# EAGLE design pixljs (EAGLE 7.7.0)
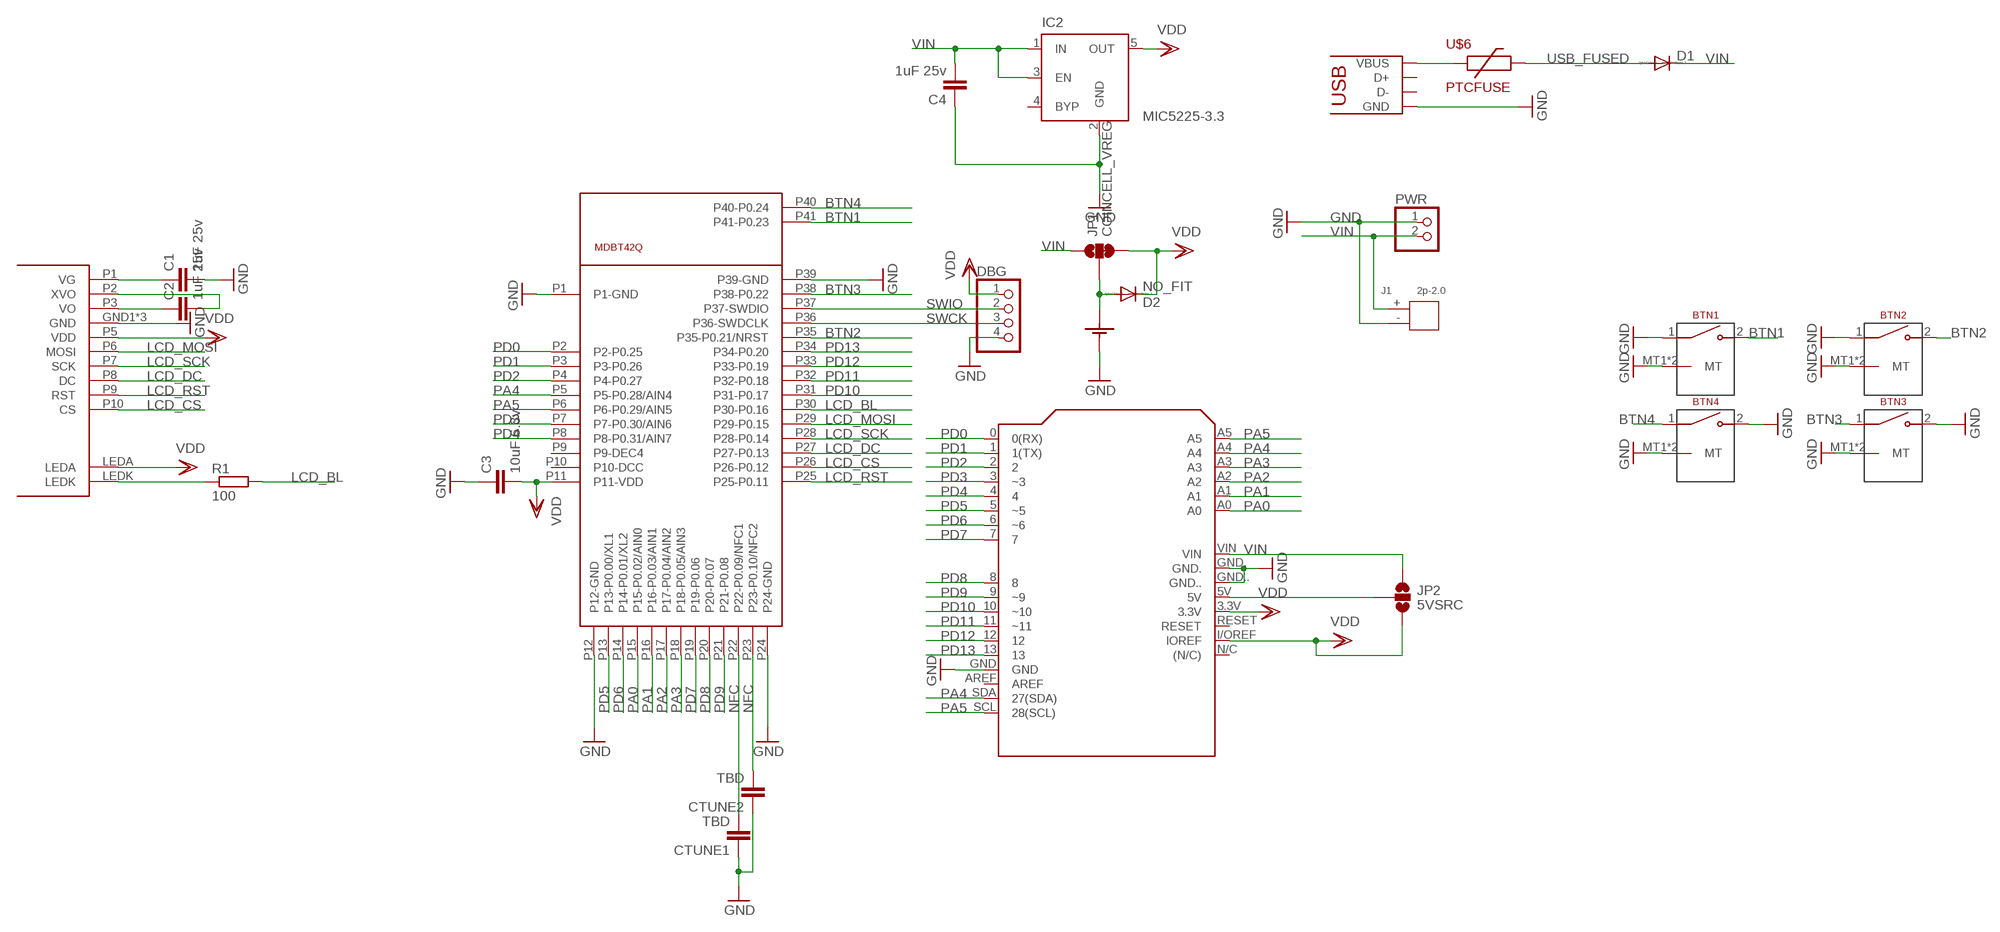
[diagram p0: schematic, sheet 1]

## Parts
BTN1  TACT_MINI_RIGHT_ANGLEMEDI  [TACT_MEDI_RIGHT_ANGLE]
BTN2  TACT_MINI_RIGHT_ANGLEMEDI  [TACT_MEDI_RIGHT_ANGLE]
BTN3  TACT_MINI_RIGHT_ANGLEMEDI  [TACT_MEDI_RIGHT_ANGLE]
BTN4  TACT_MINI_RIGHT_ANGLEMEDI  [TACT_MEDI_RIGHT_ANGLE]
C1  1uF 25v  C-EUC0603K  [C0603K]
C2  1uF 25v  C-EUC0603K  [C0603K]
C3  10uF 6.3v  C-EUC0603K  [C0603K]
C4  1uF 25v  C-EUC0603K  [C0603K]
CTUNE1  TBD  C-EUC0603K  [C0603K]
CTUNE2  TBD  C-EUC0603K  [C0603K]
D1  DIODE-SOD323-W  [SOD323-W]
D2  NO_FIT  DIODE-SOD323-W  [SOD323-W]
DBG  PINHD-1X04_2.54-S  [1X04-S]
IC2  MIC5225-3.3  MIC5219XX  [SOT23-5]
J1  2p-2.0  DIP-JST-2P-2.0  [H2-2.0-6X4.5MM]
JP1  COINCELL_VREG  JUMPER-SMT_3_1-NC_TRACE_NO-SILK  [SMT-JUMPER_3_1-NC_TRACE_NO-SILK]
JP2  5VSRC  JUMPER-SMT_3_NO_NO-SILK  [SMT-JUMPER_3_NO_NO-SILK]
PWR  PINHD-1X02_2.54-S  [1X02-S]
R1  100  R-EU_R0603  [R0603]
U$1  JHD12864  [JHD12864-G176BSW]
U$2  MDBT42Q  [MDBT40]
U$3  CR2032-SMD  [CR2032-SMD]
U$4  ARDUINO  [ARDUINO]
U$5  USB-MICROB  [USB-MICROB]
U$6  PTCFUSE  [R1210]

## Nets
BTN1: BTN1.2 U$2.P41(P41-P0.23)
BTN2: BTN2.2 U$2.P35(P35-P0.21/NRST)
BTN3: BTN3.1 U$2.P38(P38-P0.22)
BTN4: BTN4.1 U$2.P40(P40-P0.24)
GND: BTN1.1 BTN1.MT1(MT) BTN1.MT2(MT) BTN2.1 BTN2.MT1(MT) BTN2.MT2(MT) BTN3.2 BTN3.MT1(MT) BTN3.MT2(MT) BTN4.2 BTN4.MT1(MT) BTN4.MT2(MT) C1.2 C3.1 C4.1 CTUNE1.1 CTUNE2.1 DBG.4 IC2.2(GND) J1.- PWR.1 U$1.GND1(GND) U$1.GND2(GND) U$1.P4(GND) U$2.P1(P1-GND) U$2.P12(P12-GND) U$2.P24(P24-GND) U$2.P39(P39-GND) U$3.NEG(-) U$4.GND U$4.GND. U$4.GND.. U$5.GND U$5.MT1(GND) U$5.MT2(GND) U$5.P$1(GND) U$5.P$2(GND) U$5.P$3(GND) U$5.P$4(GND)
LCD_BL: R1.2 U$2.P30(P30-P0.16)
LCD_CS: U$1.P10(CS) U$2.P26(P26-P0.12)
LCD_DC: U$1.P8(DC) U$2.P27(P27-P0.13)
LCD_MOSI: U$1.P6(MOSI) U$2.P29(P29-P0.15)
LCD_RST: U$1.P9(RST) U$2.P25(P25-P0.11)
LCD_SCK: U$1.P7(SCK) U$2.P28(P28-P0.14)
N$1: D2.A JP1.2 U$3.POS1(+) U$3.POS2(+)
N$2: C2.1 U$1.P3(VO)
N$3: C2.2 U$1.P2(XVO)
N$4: C1.1 U$1.P1(VG)
N$5: R1.1 U$1.LEDK
N$6: U$5.VBUS U$6.1
N$7: JP2.2 U$4.5V
NFC: CTUNE1.2 CTUNE2.2 U$2.P22(P22-P0.09/NFC1) U$2.P23(P23-P0.10/NFC2)
PA0: U$2.P15(P15-P0.02/AIN0) U$4.A0
PA1: U$2.P16(P16-P0.03/AIN1) U$4.A1
PA2: U$2.P17(P17-P0.04/AIN2) U$4.A2
PA3: U$2.P18(P18-P0.05/AIN3) U$4.A3
PA4: U$2.P5(P5-P0.28/AIN4) U$4.A4 U$4.SDA(27(SDA))
PA5: U$2.P6(P6-P0.29/AIN5) U$4.A5 U$4.SCL(28(SCL))
PD0: U$2.P2(P2-P0.25) U$4.0(0(RX))
PD1: U$2.P3(P3-P0.26) U$4.1(1(TX))
PD2: U$2.P4(P4-P0.27) U$4.2
PD3: U$2.P7(P7-P0.30/AIN6) U$4.3(~3)
PD4: U$2.P8(P8-P0.31/AIN7) U$4.4
PD5: U$2.P13(P13-P0.00/XL1) U$4.5(~5)
PD6: U$2.P14(P14-P0.01/XL2) U$4.6(~6)
PD7: U$2.P19(P19-P0.06) U$4.7
PD8: U$2.P20(P20-P0.07) U$4.8
PD9: U$2.P21(P21-P0.08) U$4.9(~9)
PD10: U$2.P31(P31-P0.17) U$4.10(~10)
PD11: U$2.P32(P32-P0.18) U$4.11(~11)
PD12: U$2.P33(P33-P0.19) U$4.12
PD13: U$2.P34(P34-P0.20) U$4.13
SWCK: DBG.3 U$2.P36(P36-SWDCLK)
SWIO: DBG.2 U$2.P37(P37-SWDIO)
USB_FUSED: D1.A U$6.2
VDD: C3.2 D2.C DBG.1 IC2.5(OUT) JP1.3 JP2.3 U$1.LEDA U$1.P5(VDD) U$2.P11(P11-VDD) U$4.3.3V U$4.I/OREF(IOREF)
VIN: C4.2 D1.C IC2.1(IN) IC2.3(EN) J1.+ JP1.1 JP2.1 PWR.2 U$4.VIN
Unconnected: IC2.4(BYP) U$2.P9(P9-DEC4) U$2.P10(P10-DCC) U$4.AREF U$4.N/C((N/C)) U$4.RESET U$5.D+ U$5.D-

## Library data of the parts
BTN1-BTN4 = pimoroni-mechanical:TACT_MINI_RIGHT_ANGLE
C1-C4 CTUNE1 CTUNE2 = rcl:C-EU: CAPACITOR, European symbol
D1 D2 = diode:DIODE-: DIODE
DBG = pinhead-2:PINHD-1X04: PIN HEADER
IC2 = v-reg-micrel:MIC5219XX: VOLTAGE REGULATOR; OC_FARNELL: unknown; OC_NEWARK: unknown
J1 = Seeed-OPL-Connector:DIP-JST-2P-2.0: 320110049
JP1 = SparkFun-Jumpers:JUMPER-SMT_3_1-NC_TRACE: Normally closed trace jumper (1 of 2 connections) This jumper has a trace between two pads so it's normally closed (NC). The other connection is normally open (NO). Use a razor knife to open the connection. For best results follow the IPC guidelines for cutting traces: Cutout at least 0.063 mm (0.005 in). Remove all loose material to clean up the cut area. Seal the cut with an approved epoxy. Reapply solder to reclose the connection, or to close the NO connection.
JP2 = SparkFun-Jumpers:JUMPER-SMT_3_NO: Normally open jumper This jumper has three pads in close proximity to each other. Apply solder to close the connection(s).
PWR = pinhead-2:PINHD-1X02: PIN HEADER
R1 = rcl:R-EU_: RESISTOR, European symbol
U$1 = jhd_lcd:JHD12864
U$2 = mdbt42:MDBT42Q
U$3 = pimoroni-mechanical:CR2032-SMD
U$4 = arduino_jslcd:ARDUINO
U$5 = pimoroni:USB-MICROB
U$6 = pimoroni:PTCFUSE

## Board
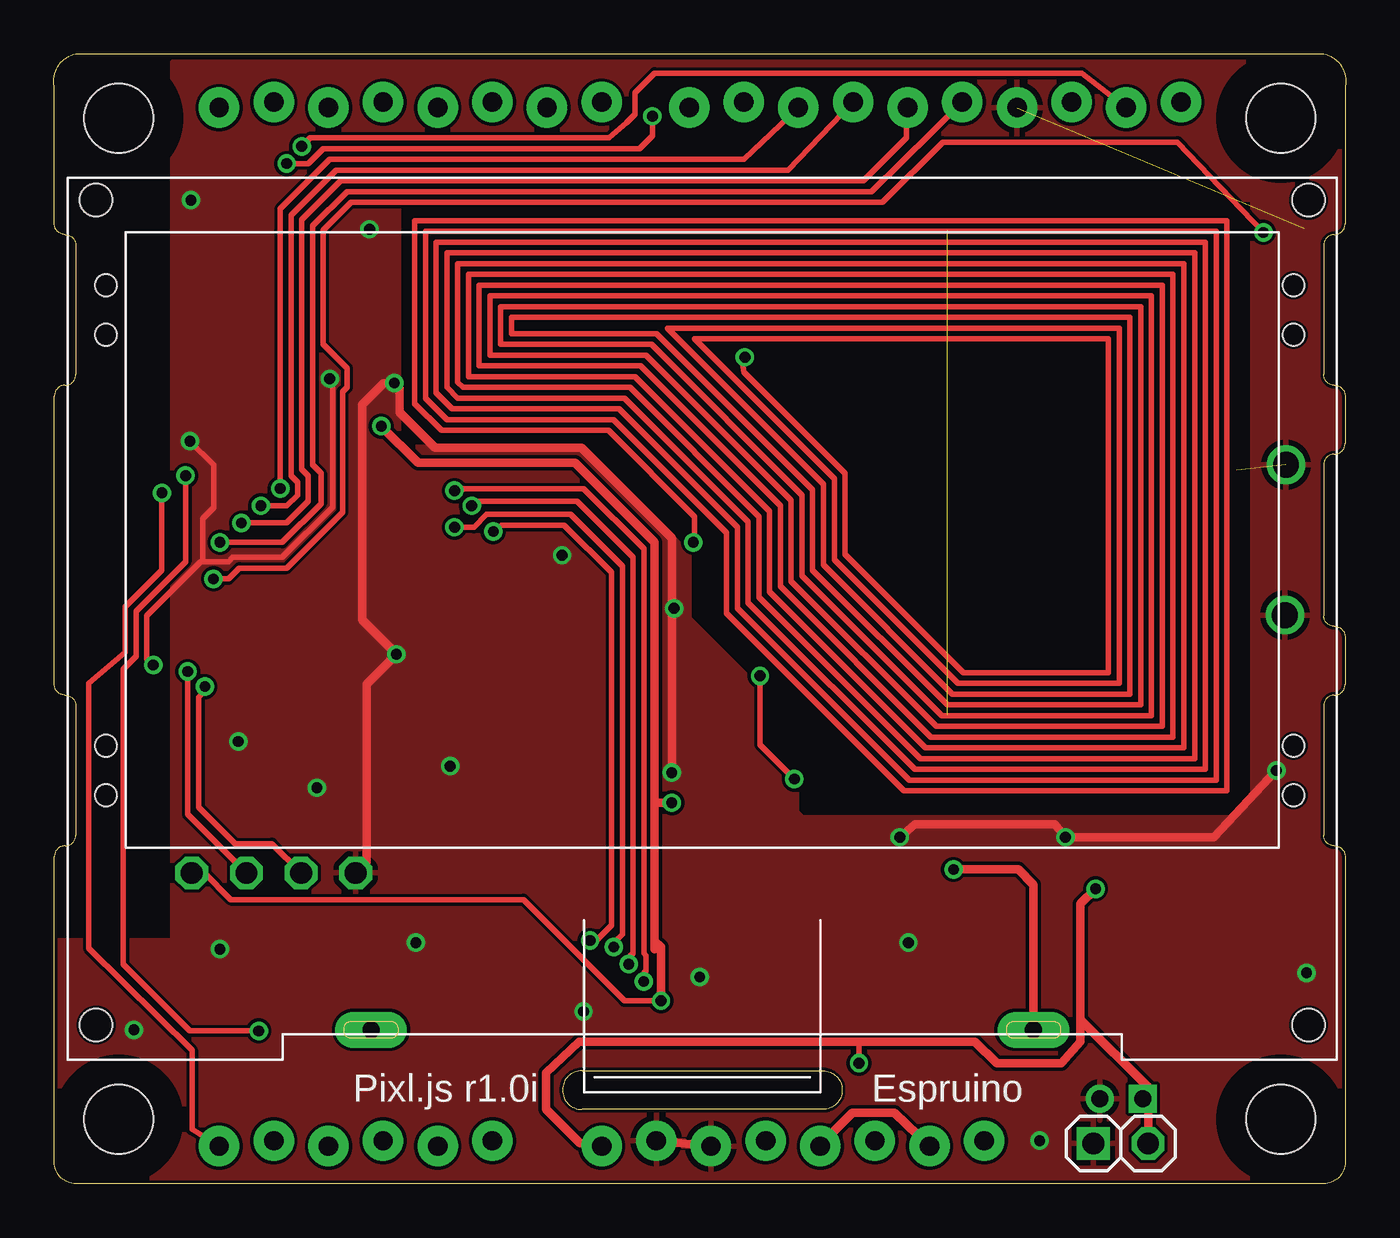
[diagram p1: board, top side]
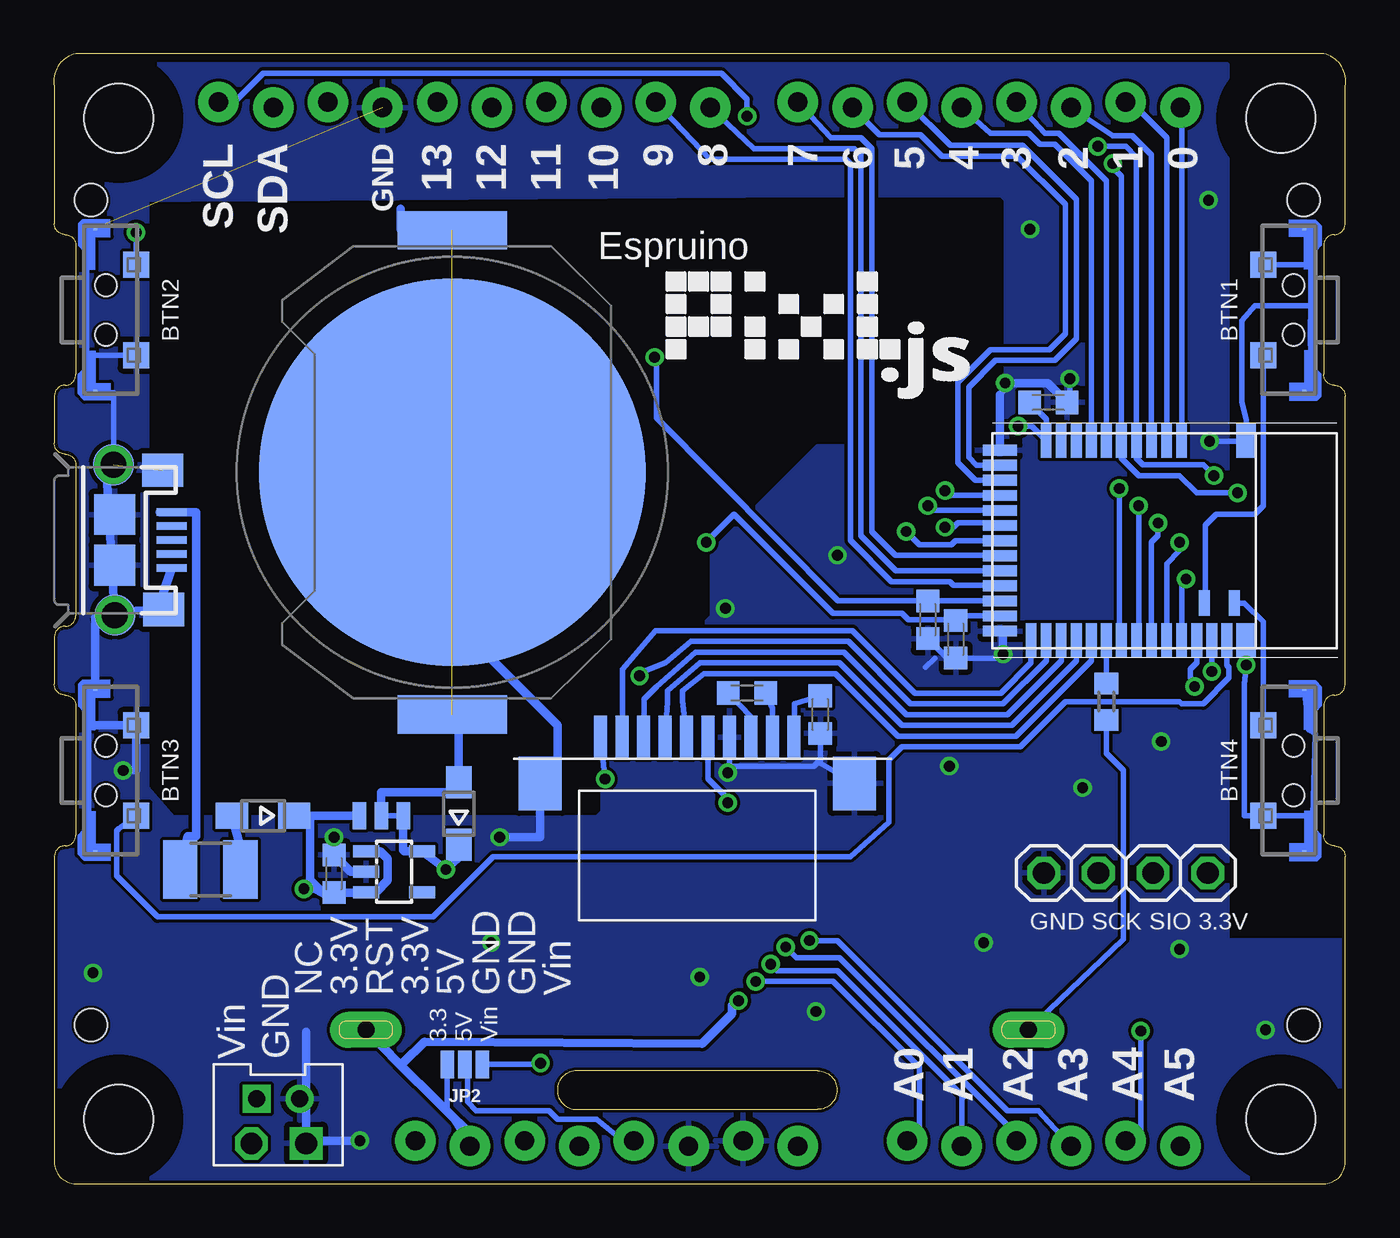
[diagram p2: board, bottom side, seen from below]

Size 60.05 x 52.5 mm. Coordinates in mm from the lower left corner, seen from the top.
Outline: 1.02,52.5 59.02,52.5 arc-90 60.02,51 60.02,44.6 arc-90 59.52,44.1 arc90 59.02,43.6 59.02,37.6 arc90 59.52,37.1 arc-90 60.02,36.6 60.02,34.4 arc-90 59.52,33.9 arc90 59.02,33.4 59.02,26.4 arc90 59.52,25.9 arc-90 60.02,25.4 60.02,23.2 arc-90 59.52,22.7 arc90 59.02,22.2 59.02,16.2 arc90 59.52,15.7 arc-90 60.02,15.2 60.02,1 arc-90 59.02,0 1.02,0 arc-90 0.02,1 0.02,15.2 arc-90 0.52,15.7 arc90 1.02,16.2 1.02,22.2 arc90 0.52,22.7 arc-90 0.02,23.2 0.02,36.6 arc-90 0.52,37.1 arc90 1.02,37.6 1.02,43.6 arc90 0.52,44.1 arc-90 0.02,44.6 0.02,51 arc-90 1.02,52.5
Copper layers (1*16): Top 0.035559375mm / dielectric 0.17018125mm / Bottom 0.035559375mm
Design rules "pimoroni_espruino *": minimum track width 8mil, minimum drill 10mil, track to track 6mil, track to pad 6mil, pad to pad 6mil, via to via 6mil, smd to smd 0mil, copper to edge 6mil, drill to drill 6mil, minimum pad ring 7mil, minimum via ring 7mil, stop-mask expansion 6mil, vias tented up to drill 21mil, thermal gap 10mil

### Footprints (pad centres in the part's own frame; a part is rotated, then mirrored left to right if it is on the bottom)
TACT_MEDI_RIGHT_ANGLE = smd 1.2 x 1.2: 1 -2.1,-1.4; 2 2.1,-1.4 | smd 0.2 x 0.2: MT1 -3.8,0.5; MT2 3.8,0.5 | hole 1: -1.15,0; 1.15,0
C0603K = smd 1.05 x 1.08: 1 -0.875,0; 2 0.875,0
SOD323-W = smd 1.5 x 1.2: A 1.45,0; C -1.45,0
1X04-S = drill 1.016 octagon: 1 -3.81,0; 2 -1.27,0; 3 1.27,0; 4 3.81,0
SOT23-5 = smd 0.55 x 1.2: 1 -0.95,-1.3; 2 0,-1.3; 3 0.95,-1.3; 4 0.95,1.3; 5 -0.95,1.3
H2-2.0-6X4.5MM = drill 0.8 pad 1.3 square: + -1,0.75 | drill 0.8 pad 1.3: - 1,0.75
SMT-JUMPER_3_1-NC_TRACE_NO-SILK = smd 0.635 x 1.27: 1 -1.016,0; 2 0,0; 3 1.016,0
SMT-JUMPER_3_NO_NO-SILK = smd 0.635 x 1.27: 1 -0.813,0; 2 0,0; 3 0.813,0
1X02-S = drill 1.016 square: 1 -1.27,0 | drill 1.016 octagon: 2 1.27,0
R0603 = smd 1 x 1.1: 1 -0.85,0; 2 0.85,0
JHD12864-G176BSW = smd 2 x 2.5 bottom: GND1 22.2,12.85; GND2 36.8,12.85 | drill 0.8 pad 1.676 long: LEDA 44.89,1.4; LEDK 14.1,1.4 | smd 0.6 x 2 bottom: P1 25,15; P2 26,15; P3 27,15; P4 28,15; P5 29,15; P6 30,15; P7 31,15; P8 32,15; P9 33,15; P10 34,15 | hole 1.5: 1.325,1.625; 57.675,1.625; 57.675,39.95; 1.325,39.95
MDBT40 = smd 1.6 x 0.9: P1 -4.65,3.8; P39 4.65,3.8 | smd 1.6 x 0.5: P2 -4.65,0.8; P3 -4.65,0.1; P4 -4.65,-0.6; P5 -4.65,-1.3; P6 -4.65,-2; P7 -4.65,-2.7; P8 -4.65,-3.4; P9 -4.65,-4.1; P10 -4.65,-4.8; P11 -4.65,-5.5; P25 4.65,-6.2; P26 4.65,-5.5; P27 4.65,-4.8; P28 4.65,-4.1; P29 4.65,-3.4; P30 4.65,-2.7; P31 4.65,-2; P32 4.65,-1.3; P33 4.65,-0.6; P34 4.65,0.1; P35 4.65,0.8; P36 4.65,1.5; P37 4.65,2.2; P38 4.65,2.9 | smd 0.5 x 1.6: P12 -4.2,-7.65; P13 -3.5,-7.65; P14 -2.8,-7.65; P15 -2.1,-7.65; P16 -1.4,-7.65; P17 -0.7,-7.65; P18 0,-7.65; P19 0.7,-7.65; P20 1.4,-7.65; P21 2.1,-7.65; P22 2.8,-7.65; P23 3.5,-7.65; P24 4.2,-7.65 | smd 1.2 x 0.5: P40 2.9,3.25; P41 2.9,1.85
CR2032-SMD = smd 18 x 18: NEG 0,0 | smd 1.77 x 5.08: POS1 11.25,0; POS2 -11.25,0
ARDUINO = drill 0.9 pad 1.88: 0 27.94,24.003; 1 25.4,24.257; 2 22.86,24.003; 3 20.32,24.257; 3.3V 0,-24.257; 4 17.78,24.003; 5 15.24,24.257; 5V 2.54,-24.003; 6 12.7,24.003; 7 10.16,24.257; 8 6.096,24.003; 9 3.556,24.257; 10 1.016,24.003; 11 -1.524,24.257; 12 -4.064,24.003; 13 -6.604,24.257; A0 15.24,-24.003; A1 17.78,-24.257; A2 20.32,-24.003; A3 22.86,-24.257; A4 25.4,-24.003; A5 27.94,-24.257; AREF -11.684,24.257; GND -9.144,24.003; GND. 7.62,-24.003; GND.. 5.08,-24.257; I/OREF -5.08,-24.257; N/C -7.62,-24.003; RESET -2.54,-24.003; SCL -16.764,24.257; SDA -14.224,24.003; VIN 10.16,-24.257
USB-MICROB = smd 0.35 x 1.4: D+ 0,2.65; D- -0.65,2.65; GND 1.3,2.65; ID 0.65,2.65; VBUS -1.3,2.65 | smd 1.546 x 1.9: MT1 -3.251,2.235; MT2 3.226,2.286 | smd 1.9 x 1.9: P$1 -1.194,0; P$2 1.168,0; P$5 -3.505,-0.051; P$6 3.48,0.025 | drill 1.2 pad 1.6: P$3 -3.505,-0.051; P$4 3.48,0
R1210 = smd 1.6 x 2.7: 1 -1.4,0; 2 1.4,0
M3 = hole 3.2: 0,0

### Placement (x,y rotation side)
BTN1  2.42,40.6 270 bottom
BTN2  57.62,40.6 90 bottom
BTN3  57.62,19.2 90 bottom
BTN4  2.42,19.2 270 bottom
C1  24.42,21.8 270 bottom
C2  27.82,22.8 0 bottom
C3  13.82,36.3 180 bottom
C4  47.02,14.4 270 bottom
CTUNE1  19.42,26.2 90 bottom
CTUNE2  18.12,25.3 90 bottom
D1  50.32,17.1 180 bottom
D2  41.22,17.2 90 bottom
DBG  10.22,14.44 180 bottom
IC2  44.22,14.5 270 bottom
J1  49.62,3.2 0 bottom
JP1  44.82,17.1 0 bottom
JP2  40.94,5.54 180 bottom
PWR  49.59,1.87 0 top
R1  11.12,22.4 90 bottom
U$1  0.64,5.75 0 top
U$2  8.42,29.88 270 bottom
U$3  41.52,33.05 270 bottom
U$4  35.62,26 0 bottom
U$5  57.22,29.9 270 bottom
U$6  52.77,14.6 0 bottom
U$7  [M3]  3.02,3 0 top
U$8  [M3]  3.02,49.5 0 top
U$9  [M3]  57.02,49.5 0 top
U$10  [M3]  57.02,3 0 top

### Tracks (layer width: path | path; a pad name or v marks a point on that pad's centre or on a via)
BTN1
  Bottom 0.254: BTN1.2 3.82,31.5 4.22,31.1 6.02,31.1 6.52,30.6 6.52,27.03 U$2.P41
BTN2  (via drill 0.5)
  Top 0.254: v7.42,28.1 8.12,28.1 8.62,28.6 10.82,28.6 13.42,31.2 13.42,36.8 13.62,37 13.62,37.9 12.52,39 12.52,44.3 13.82,45.6 38.52,45.6 41.32,48.4 52.22,48.4 v56.22,44.2
  Bottom 0.254: U$2.P35 7.62,27.9 v7.42,28.1 | v56.22,44.2 BTN2.2
BTN3
  Bottom 0.254: U$2.P38 5.52,24.1 5.42,24 5.42,23.5 6.62,22.3 7.62,22.3 7.72,22.4 13.02,22.4 15.12,20.3 20.62,20.3 21.22,19.7 21.22,16.8 23.02,15.2 39.62,15.2 42.42,12.4 55.22,12.4 57.12,14.3 57.12,16.4 57.02,16.5 BTN3.1
BTN4
  Bottom 0.254: U$2.P40 4.7,26.98 3.82,26.1 BTN4.1
GND  (via drill 0.5)  (2 unrouted)
  Top 0.254: U$4.GND.. 29.95,1.87 | v6.32,34.5 7.42,33.4 7.42,31.4 6.92,30.9 6.92,29 7.02,28.9 | 16.07,36.95 v15.82,37.2 | 7.02,28.9 6.82,28.9 4.32,26.4 4.32,24.4 v4.62,24.1 | 7.02,28.9 8.12,28.9 8.32,29.1 10.62,29.1 12.95,31.43 12.95,37.27 v12.82,37.4
  Top 0.406: U$4.GND. U$4.GND.. | v28.72,19.1 28.72,30 24.52,34.2 17.72,34.2 16.07,35.85 16.07,36.95 | v15.82,37.2 15.32,37.2 14.32,36.2 14.32,26.2 v15.92,24.6 14.53,23.21 14.53,14.94 DBG.4 | v39.32,16.1 40.02,16.7 46.52,16.7 v47.02,16.1 53.92,16.1 v56.82,19.2
  Bottom 0.254: 15.52,37.2 16.07,36.65 | U$2.P12 16.05,34.1 | U$2.P24 15.92,25.53 | v6.32,34.5 4.65,34.5 U$2.P1 4.62,35.5 4.82,36.3 4.82,40.1 4.22,40.8 1.62,40.8 | U$2.P39 v4.62,24.1 4.72,23.2 4.72,17.1 BTN4.2 1.52,17.1 | U$1.P4 28.64,19.4 | 28.64,19.4 28.64,19.18 v28.72,19.1 | U$1.GND1 24.42,19.53 C1.2 24.42,19.7 24.72,19.4 28.64,19.4 | BTN1.MT1 1.72,44.15 1.62,42.8 1.62,42.7 | 1.62,42.7 1.62,40.8 | 1.62,40.8 arc-4 1.57,37.05 BTN1.MT2 | BTN4.MT2 1.82,15.7 1.62,15.9 1.52,17.1 | BTN4.MT1 1.72,21.1 1.42,20.9 1.52,17.1 | v12.82,37.4 12.82,36.42 C3.1 | BTN2.MT2 58.32,44.4 58.52,44.2 58.52,38.2 | 58.52,38.2 58.52,37.2 BTN2.MT1 57.28,36.75 U$5.P$3 57.62,33.75 | BTN2.1 58.22,38.5 58.52,38.2 | 58.42,15.2 58.42,21.3 58.42,22 BTN3.MT2 | 58.12,26.32 U$5.P$4 57.62,26.57 | 54.97,27.44 U$5.MT2 | 19.1,24.43 19.52,24 | v15.92,24.6 16.1,24.43 CTUNE2.1 18.52,24.43 CTUNE1.1 | BTN1.1 1.62,42.7
  Bottom 0.406: C3.1 13.85,37.2 15.52,37.2 v15.82,37.2 | 16.07,36.65 U$2.P12 | 15.92,25.53 v15.92,24.6 | IC2.2 46.25,14.5 C4.1 v47.02,16.1 | 58.42,21.3 BTN3.2 56.22,19.2 v56.82,19.2 | BTN3.MT2 58.12,26.32 | U$5.P$4 57.62,33.75 | U$5.GND 54.97,27.44 | U$5.MT2 57.62,26.57 | U$1.GND2 37.44,17.8 | 37.44,17.8 37.44,16.1 v39.32,16.1 | U$3.NEG 44.87,29.55 36.62,21.3 36.62,17.8 37.44,17.8 | 48.32,3.95 48.32,7.05 | v45.82,2 48.19,2 PWR.1 48.32,3.8 48.32,3.95 | J1.- 48.32,3.95
  other vias: 30.02,9.6 39.72,11.2 16.82,11.2 7.72,10.9 18.42,19.4 14.67,44.35 23.62,29.2 12.22,18.4 24.62,8 6.37,45.7 8.57,20.55 28.83,26.74 58.22,9.8 3.72,7.15
  pour Top: 5.52,52.1 60.12,52.1 60.12,45.7 24.67,45.95 16.22,45.95 16.02,45.75 16.02,34.25 24.67,34.1 29.52,29.25 29.52,26.25 34.52,21.25 34.52,17.25 34.77,17 54.77,17 55.72,18.15 55.72,45.6 60.12,45.6 60.12,0 0.02,0 0.02,11.3 5.52,11.3
  pour Bottom: 5.52,52 60.12,52 60.12,45.7 24.67,45.95 15.97,45.95 15.77,45.75 15.77,34.5 15.52,34.25 24.52,34.25 29.42,29.35 29.42,26.35 34.52,21.25 34.52,17.25 34.77,17 54.52,17 55.72,18.4 55.72,45.6 60.12,45.6 60.12,0 0.02,0 0.02,11.3 5.52,11.3
LCD_BL
  Bottom 0.254: R1.2 U$2.P30
LCD_CS  (via drill 0.5)
  Top 0.254: v32.82,23.6 32.82,20.4 v34.42,18.8
  Bottom 0.254: U$2.P26 13.92,24.3 15.92,22.3 20.22,22.3 23.12,25.2 30.42,25.2 31.62,24.2 32.62,23.8 v32.82,23.6 | v34.42,18.8 34.62,20.8 34.62,20.89 U$1.P10
LCD_DC
  Bottom 0.254: U$2.P27 13.22,24.3 15.72,21.8 20.42,21.8 23.32,24.7 30.22,24.7 32.02,23.1 32.62,22.5 32.62,22.29 U$1.P8
LCD_MOSI
  Bottom 0.254: U$2.P29 11.82,24.3 15.32,20.8 20.82,20.8 23.72,23.7 29.82,23.7 30.82,22.9 30.82,22.45 U$1.P6
LCD_RST
  Bottom 0.254: U$2.P25 14.62,24.2 16.02,22.8 20.02,22.8 22.92,25.7 32.07,25.7 33.62,23.9 33.62,22.29 U$1.P9
LCD_SCK
  Bottom 0.254: U$2.P28 12.52,24.3 15.52,21.3 20.62,21.3 23.52,24.2 30.02,24.2 31.52,22.9 31.52,22.39 U$1.P7
N$1  (1 unrouted)
  Bottom 0.254: 44.87,17.15 JP1.2
  Bottom 0.406: 43.92,45.3 43.92,44.35 U$3.POS2 | U$3.POS1 42.87,21.4 41.22,21.4 D2.A 41.67,18.2 43.82,18.2 | 44.82,18.2 43.82,18.2 | 43.82,18.2 43.81,18.18 44.81,18.18 44.82,18.2 | 44.82,18.2 JP1.2
N$2
  Bottom 0.254: U$1.P3 27.64,21.7 C2.1
N$3
  Bottom 0.254: U$1.P2 26.64,22.09 C2.2
N$4
  Bottom 0.254: C1.1 25.62,22.29 U$1.P1
N$5
  Bottom 0.254: R1.1 11.12,20 10.32,19.2 10.32,11.37 U$1.LEDK
N$6
  Bottom 0.406: 55.12,31.2 U$5.VBUS 53.42,31.2 53.42,16.15 53.82,16.15 U$6.1
N$7
  Bottom 0.254: U$4.5V 33.69,2.07 34.82,3 36.62,3 37.02,3.4 40.42,3.4 40.82,3.8 40.82,5.58 JP2.2
NFC  (via drill 0.5)
  Top 0.254: v32.12,38.4 31.97,38.35 32.07,37.7 36.77,33 36.77,29.25 42.27,23.75 49.02,23.75 49.02,39.25 29.77,39.25 36.27,32.75 36.27,29 42.02,23.25 49.52,23.25 49.52,39.75 28.52,39.75 35.77,32.5 35.77,28.75 41.77,22.75 50.02,22.75 50.02,40.25 21.27,40.25 21.27,39.5 28.02,39.5 35.27,32.25 35.27,28.5 41.52,22.25 50.52,22.25 50.52,40.75 20.77,40.75 20.77,39 27.77,39 34.77,32 34.77,28.25 41.27,21.75 51.02,21.75 51.02,41.25 20.27,41.25 20.27,38.5 27.52,38.5 34.27,31.75 34.27,28 41.02,21.25 51.52,21.25 51.52,41.75 19.77,41.75 19.77,38 27.27,38 33.77,31.5 33.77,27.75 40.77,20.75 52.02,20.75 52.02,42.25 19.27,42.25 19.27,37.5 27.02,37.5 33.27,31.25 33.27,27.5 40.52,20.25 52.52,20.25 52.52,42.75 18.77,42.75 18.77,37.25 19.02,37 26.77,37 32.77,31 32.77,27.25 40.27,19.75 53.02,19.75 53.02,43.25 18.27,43.25 18.27,37 18.77,36.5 26.52,36.5 32.27,30.75 32.27,27 40.02,19.25 53.52,19.25 53.52,43.75 17.77,43.75 17.77,36.75 18.52,36 26.27,36 31.77,30.5 31.77,26.75 39.77,18.75 54.02,18.75 54.02,44.25 17.27,44.25 17.27,36.5 18.27,35.5 26.02,35.5 31.27,30.25 31.27,26.5 39.52,18.25 54.52,18.25 54.52,44.75 16.77,44.75 16.77,36.25 18.02,35 25.77,35 29.77,31 29.77,29.65 v29.72,29.8
  Bottom 0.254: 16.09,26.4 U$2.P23 17.84,26.38 18.02,26.2 18.12,26.2 | U$2.P22 19.62,27.08 | 19.62,27.08 23.6,27.08 32.02,35.6 32.02,38.4 v32.12,38.4 | 18.12,26.2 20.32,26.2 20.62,26.5 23.82,26.5 28.42,31.1 v29.72,29.8 | CTUNE1.2 19.62,27.07 19.62,27.08 | CTUNE2.2 18.12,26.2
PA0  (via drill 0.5)
  Top 0.254: v18.62,32.2 18.92,32.2 19.02,32.3 24.62,32.3 27.42,29.5 27.42,10.7 27.52,10.6 27.52,9.9 27.42,9.8 v27.42,9.4
  Bottom 0.254: U$2.P15 18.3,31.98 v18.62,32.2 | v27.42,9.4 23.82,9.4 19.82,5.4 19.82,1.91 19.86,1.87 U$4.A0
PA1  (via drill 0.5)
  Top 0.254: v26.72,10.2 26.72,10.5 26.92,10.7 26.92,29.1 24.32,31.7 19.62,31.7 v19.42,31.5
  Bottom 0.254: v26.72,10.2 26.42,9.9 23.62,9.9 17.77,4.05 17.84,3.98 U$4.A1 | v19.42,31.5 19.22,31.3 16.09,31.3 U$2.P16
PA2  (via drill 0.5)
  Top 0.254: v26.02,11 26.02,11.2 26.42,11.6 26.42,28.7 24.02,31.1 20.12,31.1 19.52,30.5 v18.62,30.5
  Bottom 0.254: 14.89,1.87 15.17,2.15 | 15.17,2.15 23.52,10.5 25.52,10.5 v26.02,11 | v18.62,30.5 18.22,30.5 18.02,30.7 16.19,30.7 U$2.P17 | U$4.A2 15.3,2.02 15.17,2.15
PA3  (via drill 0.5)
  Top 0.254: v20.42,30.3 20.52,30.3 20.82,30.6 23.72,30.6 25.92,28.4 25.92,12 25.02,11.1 25.02,11.2 v24.92,11.3
  Bottom 0.254: U$2.P18 18.14,29.88 18.32,29.7 19.82,29.7 v20.42,30.3 | v24.92,11.3 23.62,11.3 15.72,3.4 14.29,3.4 U$4.A3
PA4  (via drill 0.5)
  Top 0.254: v11.52,48.2 11.92,48.6 25.82,48.6 26.62,49.29 27.02,49.7 27.02,50.7 27.92,51.6 47.78,51.6 U$4.SDA | v6.12,32.9 6.12,28.9 3.82,26.6 3.82,24.5 3.22,23.9 3.22,10.2 6.32,7.1 v9.52,7.1
  Bottom 0.254: v11.52,48.2 10.22,48.2 9.72,47.7 U$2.P5 9.72,33.7 9.42,33.4 6.62,33.4 v6.12,32.9 | v9.52,7.1 9.52,1.97 10.12,1.97 U$4.A4
PA5  (via drill 0.5)
  Top 0.254: v10.82,47.4 11.82,47.4 12.52,48.1 27.22,48.1 27.82,48.7 v27.82,49.6 | v5.02,32.1 5.02,28.5 3.32,26.8 3.32,24.7 1.62,23.25 1.62,10.95 6.42,6.2 6.42,2.53 U$4.A5
  Bottom 0.254: v10.82,47.4 10.82,47.2 10.42,46.8 U$2.P6 10.42,33.7 9.62,32.9 7.72,32.9 6.92,32.1 v5.02,32.1 | v27.82,49.6 27.82,50.4 29.02,51.6 50.32,51.6 51.79,50.14 U$4.SCL
PD0
  Bottom 0.254: U$2.P2 7.62,50.09 U$4.0
PD1
  Bottom 0.254: U$2.P3 8.32,48.6 9.62,49.9 9.99,49.9 U$4.1
PD2
  Bottom 0.254: U$2.P4 9.02,47.8 9.92,48.7 10.83,48.7 U$4.2
PD3
  Bottom 0.254: U$2.P7 11.12,46.6 13.32,48.8 13.97,48.8 U$4.3
PD4
  Bottom 0.254: U$2.P8 11.82,46.6 13.52,48.3 14.22,48.3 14.72,48.8 16.51,48.8 U$4.4
PD5
  Bottom 0.254: U$2.P13 17.15,33.38 17.52,33.75 17.52,37 16.27,38.25 13.52,38.25 12.52,39.25 12.52,45.75 15.02,48.25 18.38,48.25 U$4.5
PD6
  Bottom 0.254: U$2.P14 17.2,32.68 18.02,33.5 18.02,37.25 16.52,38.75 13.77,38.75 13.02,39.5 13.02,45.5 15.27,47.75 18.77,47.75 19.77,48.75 21.67,48.75 U$4.6
PD7
  Bottom 0.254: U$2.P19 16.09,29.2 20.92,29.2 22.02,30.3 22.02,48.1 22.52,48.6 23.93,48.6 U$4.7
PD8
  Bottom 0.254: U$2.P20 20.9,28.48 22.52,30.1 22.52,47.8 22.82,48.1 27.5,48.1 U$4.8
PD9
  Bottom 0.254: U$4.9 29.54,47.6 23.22,47.6 23.02,47.4 23.02,29.9 21.1,27.98 18.4,27.98 18.22,27.8 16.09,27.8 U$2.P21
PD10  (via drill 0.5)
  Top 0.254: v10.52,32.3 10.52,45.3 12.82,47.6 32.08,47.6 U$4.10
  Bottom 0.254: v10.52,32.3 10.52,25.33 U$2.P31
PD11  (via drill 0.5)
  Top 0.254: v9.62,31.5 10.82,31.5 11.32,32 11.32,32.6 11.02,32.9 11.02,45 13.12,47.1 34.12,47.1 U$4.11
  Bottom 0.254: v9.62,31.5 9.62,25.23 U$2.P32
PD12  (via drill 0.5)
  Top 0.254: v8.72,30.7 10.82,30.7 11.82,31.7 11.82,32.9 11.52,33.2 11.52,44.8 13.32,46.6 37.62,46.6 39.62,48.6 39.62,50.07 U$4.12
  Bottom 0.254: v8.72,30.7 8.72,30.1 9.02,29.8 U$2.P33
PD13  (via drill 0.5)
  Top 0.254: v7.72,29.8 10.62,29.8 12.42,31.6 12.42,33 12.02,33.4 12.02,44.5 13.62,46.1 38,46.1 U$4.13
  Bottom 0.254: v7.72,29.8 7.72,29.4 8.32,28.8 U$2.P34
SWCK  (via drill 0.5)
  Top 0.254: v7.02,23.1 7.02,22.9 6.72,22.6 6.72,17.5 8.42,15.8 10.13,15.8 DBG.3
  Bottom 0.254: 6.82,25.5 U$2.P36 6.92,24.2 7.22,23.9 7.22,23.5 7.02,23.3 v7.02,23.1
SWIO  (via drill 0.5)
  Top 0.254: v6.22,23.8 6.22,17.16 DBG.2
  Bottom 0.254: U$2.P37 v6.22,23.8
USB_FUSED
  Bottom 0.406: U$6.2 51.37,15.6 D1.A
VDD  (via drill 0.5)
  Top 0.254: v28.22,8.5 26.52,8.5 21.82,13.2 8.22,13.2 6.99,14.44 DBG.1
  Top 0.406: U$4.3.3V 35.69,1.87 37.12,3.3 39.07,3.3 U$4.I/OREF | U$1.LEDA 45.53,13.89 44.82,14.6 v41.82,14.6 | v28.22,8.5 28.22,11 27.92,11.3 | 27.92,10.9 27.92,11.3 | 27.92,17.7 27.92,29.8 24.22,33.5 16.92,33.5 v15.22,35.2 | 27.92,11.3 27.92,17.7 | 27.92,17.7 v28.72,17.7
  Bottom 0.254: C3.2 13.92,35.52 U$2.P11 14.59,35.2 v15.22,35.2 | 40.02,1.95 U$4.I/OREF 41.76,3.42 JP2.3 | v28.22,8.5 28.32,8.5 28.52,8.3 | U$1.P5 29.64,18.82 28.52,17.7 v28.72,17.7 | 43.81,15.48 43.77,15.45
  Bottom 0.406: 43.77,15.45 IC2.5 42.87,15.4 v41.82,14.6 41.22,15.15 D2.C | JP1.3 43.81,15.48 | 40.02,1.95 40.33,1.95 44.02,5.6 | 28.52,8.3 28.52,7.9 29.92,6.5 42.82,6.6 43.82,5.6 44.02,5.6 | 44.02,5.6 U$1.LEDA
VIN  (via drill 0.5)
  Top 0.254: v37.42,5.6 37.42,6.6
  Top 0.406: U$4.VIN 24.45,1.87 22.87,3.45 22.87,5.15 24.42,6.6 37.42,6.6 42.82,6.6 43.82,5.6 46.82,5.6 47.72,6.6 47.72,7.62 | 47.72,7.62 47.72,13 v48.42,13.7 | PWR.2 50.86,3.8 50.86,3.95 | 50.86,3.95 50.86,4.48 47.72,7.62 | J1.+ 50.86,3.95
  Bottom 0.254: 45.55,13.53 IC2.3 45.47,13.6 45.02,13.6 | IC2.1 44.87,15.45 | 47.52,13.5 47.05,13.5 C4.2 | 48.12,16.95 D1.C | JP2.1 37.48,5.54 v37.42,5.6 | 51.02,2.03 PWR.2
  Bottom 0.406: C4.2 45.55,13.53 | 44.87,15.45 44.52,15.1 44.52,14.1 45.02,13.6 | 48.12,16.95 48.12,14.1 47.52,13.5 47.92,13.7 v48.42,13.7 | D1.C JP1.1

### Text on the board
tNames: Pixl.js r1.0i | Espruino
bNames: Espruino | GND SCK SIO 3.3V | NC / 3.3V / RST / 3.3V / 5V / GND / GND / Vin | 3.3 / 5V / Vin | Vin / GND